# EAGLE schematic sdc schematic (EAGLE 9.6.2)
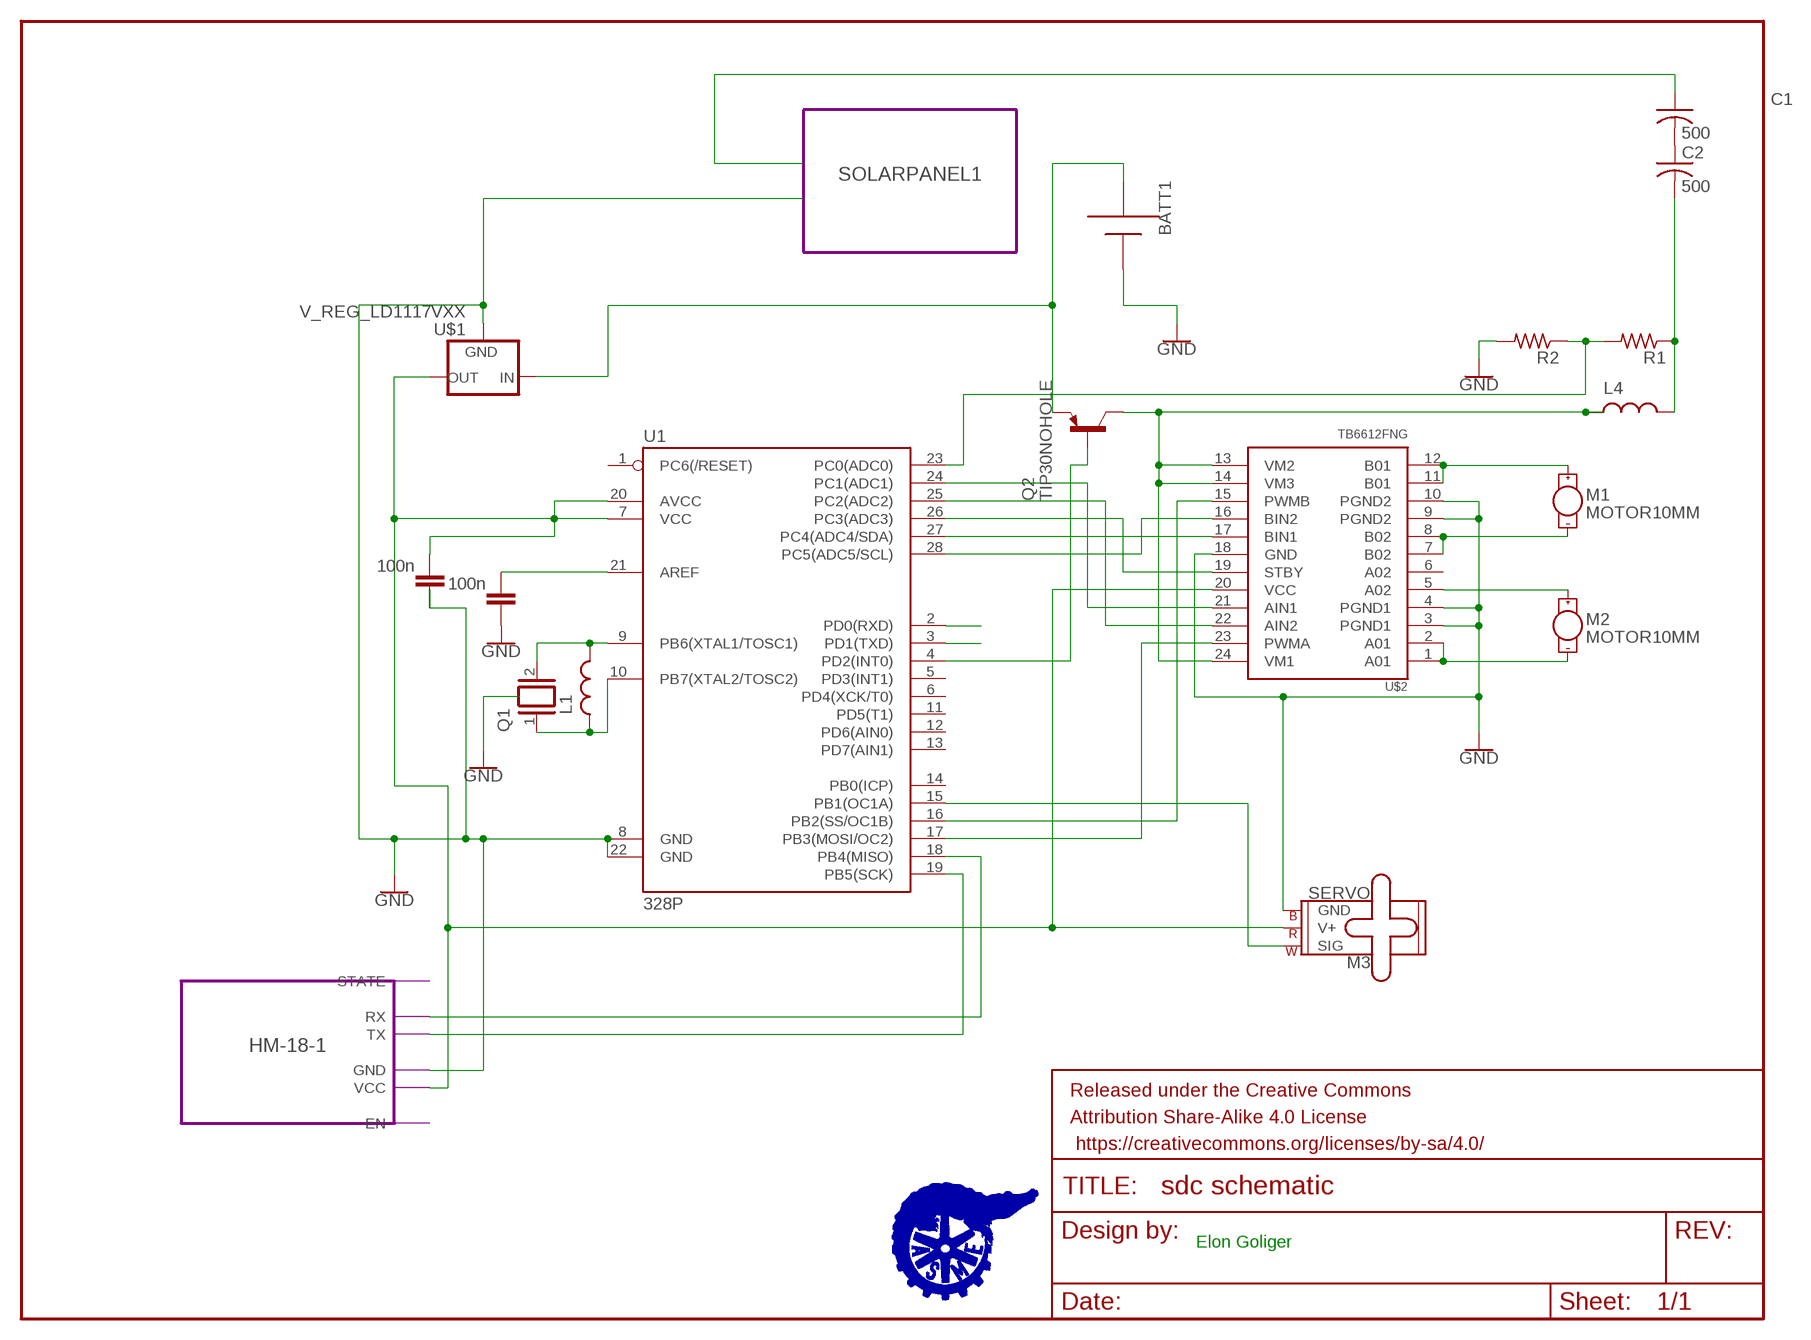
[diagram p0: schematic, sheet 1]
C3 (C): CAPACITANCE: 100n
C4 (C): CAPACITANCE: 100n

## Parts
BATT1  AAA  [12BH412]
C1  500  C-US325-182X374  [C325-182X374]
C2  500  C-US325-182X374  [C325-182X374]
FRAME1  FRAME-LETTER  [CREATIVE_COMMONS]
L1  L  (no package)
L4  L  (no package)
M1  MOTOR10MM  [VIBE-MOTOR-10MM]
M2  MOTOR10MM  [VIBE-MOTOR-10MM]
M3  SERVO  [1X03]
Q1  XTAL  [Q]
Q2  TIP30NOHOLE  [TO220-NOHOLE]
R1  R-US_0207/10  [0207/10]
R2  R-US_0207/10  [0207/10]
U1  328P  ATMEGA328P_PDIP  [DIP28]
U$1  V_REG_LD1117VXX  [78XXL]
U$2  TB6612FNG  [SSOP24]

## Module instances
SOLARPANEL1 = SOLARPANEL
HM-18-1 = HM-18

## Nets
GND: BATT1.+ M3.3(GND) R2.2 U1.8(GND) U1.22(GND) U$1.IN(GND) U$2.3(PGND1) U$2.4(PGND1) U$2.9(PGND2) U$2.10(PGND2) U$2.18(GND) ; port HM-18-1.GND
N$1: U1.18(PB4(MISO)) ; port HM-18-1.RX
N$2: U1.21(AREF)
N$3: C1.2 C2.1
N$4: U1.28(PC5(ADC5/SCL)) U$2.16(BIN2)
N$5: U1.2(PD0(RXD))
N$6: U1.27(PC4(ADC4/SDA)) U$2.17(BIN1)
N$7: U1.19(PB5(SCK)) ; port HM-18-1.TX
N$8: Q2.1(B) U1.4(PD2(INT0))
N$9: U1.25(PC2(ADC2)) U$2.22(AIN2)
N$10: M1.+ U$2.11(B01) U$2.12(B01)
N$11: M1.- U$2.7(B02) U$2.8(B02)
N$12: U1.24(PC1(ADC1)) U$2.21(AIN1)
N$13: U1.26(PC3(ADC3)) U$2.19(STBY)
N$14: M2.+ U$2.5(A02)
N$15: M2.- U$2.1(A01) U$2.2(A01)
N$16: L4.1 Q2.2(C) U$2.13(VM2) U$2.14(VM3) U$2.24(VM1)
N$17: C1.1
N$18: L1.2 Q1.2 U1.9(PB6(XTAL1/TOSC1))
N$19: BATT1.- Q2.3(E) U$1.OUT(IN)
N$20: U1.17(PB3(MOSI/OC2)) U$2.23(PWMA)
N$21: M3.2(V+) U1.7(VCC) U1.20(AVCC) U$1.GND(OUT) U$2.20(VCC) ; port HM-18-1.VCC
N$22: U1.16(PB2(SS/OC1B)) U$2.15(PWMB)
N$23: L1.1 Q1.1 U1.10(PB7(XTAL2/TOSC2))
N$24: R1.2 R2.1 U1.23(PC0(ADC0))
N$25: C2.2 L4.2 R1.1
N$26: M3.1(SIG) U1.15(PB1(OC1A))
N$27: U1.3(PD1(TXD))
Unconnected: U1.1(PC6(/RESET)) U1.5(PD3(INT1)) U1.6(PD4(XCK/T0)) U1.11(PD5(T1)) U1.12(PD6(AIN0)) U1.13(PD7(AIN1)) U1.14(PB0(ICP)) U$2.6(A02)

## Notes on the sheet
- Elon Goliger

## Library data of the parts
BATT1 = adafruit:AAA: AAA PC pin holder Mouser part #12BH412 - but pretty much any 1x AAA battery holder should be the same http://www.ladyada.net/library/pcb/eaglelibrary.html
C1 C2 = rcl:C-US: CAPACITOR, American symbol; SPICEPREFIX: C
FRAME1 = SparkFun-Aesthetics:FRAME-LETTER: Schematic Frame - Letter Standard 8.5x11 US Letter frame
L1 L4 = ngspice-simulation:L: INDUCTOR
M1 M2 = SparkFun-Electromechanical:MOTOR: Motor (Single-Phase) Two-terminal, single-phase motors. SparkFun Products Vibration Motor <https://www.sparkfun.com/products/8449> (ROB-08449) Physical dimension and wire connections for this powerful vibration motor. Motor has a self adhesive backing.; PROD_ID: COMP-08572; SF_SKU: ROB-08449
M3 = SparkFun-Electromechanical:SERVO: Servo Motor 3-pin connector for a standard servo motor (voltage supply, ground, and control signal.) SparkFun Products Servo - Generic (Sub-Micro Size) <https://www.sparkfun.com/products/9065> (ROB-09065) Servo - Generic High Torque Continuous Rotation (Standard Size) <https://www.sparkfun.com/products/9347> (ROB-09347) Servo - Generic High Torque (Standard Size) <https://www.sparkfun.com/products/11965> (ROB-11965)
Q1 = special:XTAL: CRYSTAL
Q2 = adafruit:TIP30: PNP Transistor
R1 R2 = rcl:R-US_: RESISTOR, American symbol; SPICEPREFIX: R
U1 = SparkFun-IC-Microcontroller:ATMEGA328P_PDIP: Atmel 328P Through hole ATMEGA328P uC used in the Arduino 32kb flash, 1k EEPROM, 2k SRAM Datasheet <http://www.sparkfun.com/datasheets/Components/SMD/ATMega328.pdf> SparkFun Products Storefront component: AVR 28 Pin 20MHz 32K 6A/D - ATMega328P <https://www.sparkfun.com/products/9061> (COM-09061) SparkFun Simon Says - Through-Hole Soldering Kit <https://www.sparkfun.com/products/10547> (KIT-10547) SparkFun Learn to Solder - Simon Says <https://www.sparkfun.com/products/13708> (KIT-13708) SparkFun BigTime Watch Kit <https://www.sparkfun.com/products/11734> (KIT-11734) SparkFun ClockIt <https://www.sparkfun.com/products/10930> (KIT-10930) SparkFun Serial Enabled LCD Kit <https://www.sparkfun.com/products/10097> (LCD-10097) SparkFun Simon Tilts - Through Hole Soldering Kit <https://www.sparkfun.com/products/12634> (KIT-12634) SparkFun Frequency Counter Kit <https://www.sparkfun.com/products/10140> (KIT-10140) FabFM Radio Kit <https://www.sparkfun.com/products/11043> (KIT-11043) SparkFun Binary Blaster Kit <https://www.sparkfun.com/products/12037> (KIT-12037) SparkFun Metro-Gnome <https://www.sparkfun.com/products/9236> (KIT-09236) ATmega328 with Arduino Optiboot (Uno) <https://www.sparkfun.com/products/10524> (DEV-10524); PROD_ID: IC-09136
U$1 = SparkFun-IC-Power:V_REG_LD1117VXX: LD1117VXX voltage regulator. We carry the 3.3V version (COM-00526) in TO-220 package.
U$2 = SparkFun-IC-Special-Function:TB6612FNG: Toshiba 1A dual motor driver IC-09363; PROD_ID: IC-09363

## Module SPARKFUN3.3VREGULATOR
Ports: 

### Library data of the parts

## Module SOLARPANEL
Ports: 

### Library data of the parts

## Module HM-18
Ports: STATE(io) RX(io) TX(io) GND(io) VCC(io) EN(io)

### Library data of the parts

## Module S9V11F3S5CMA
Ports: OUT(io) GND(io) IN(io) EN(io) PG(io) SEL(io) REG20B(io)

### Library data of the parts